# EAGLE design Battery_Monitoring_V2 (EAGLE 9.1.3)

## Sheet 1 of 2
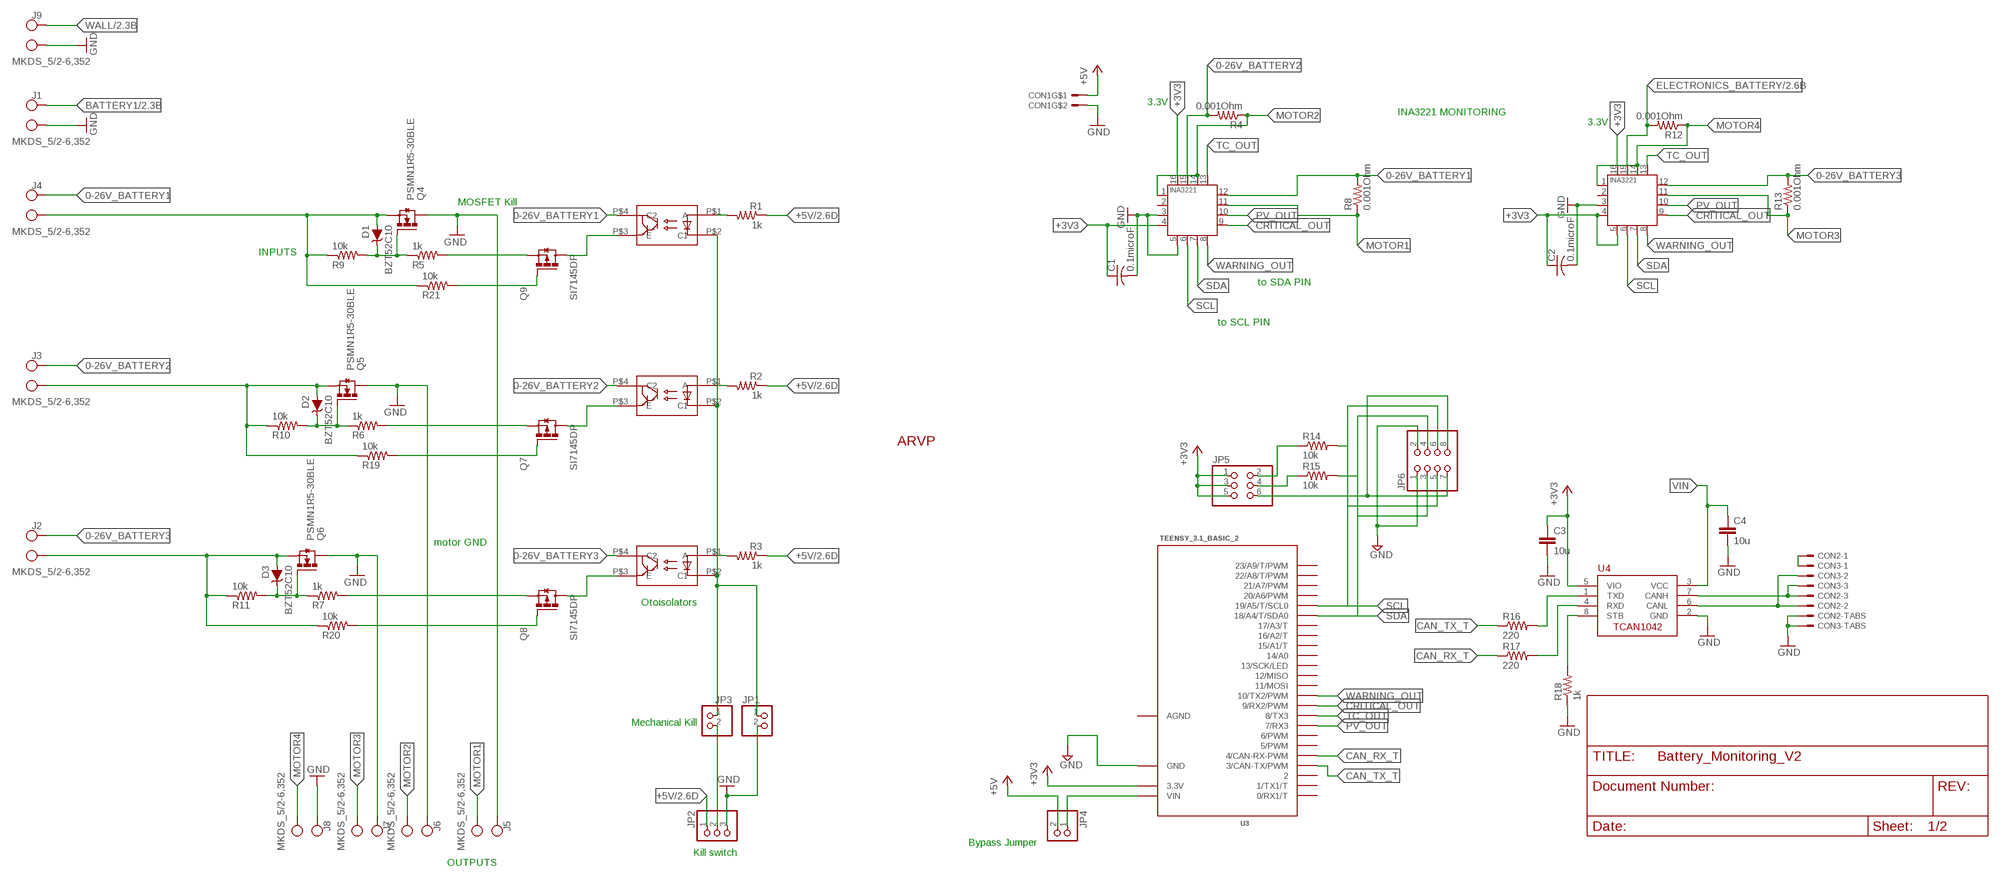
[diagram p0: schematic, sheet 1]

### Parts
ARVP1  ARVP_LOGO  [ARVP]
C1  0.1microF  C-USC2012  [C2012]
C2  0.1microF  C-USC2012  [C2012]
C3  10u  C-EUC0805  [C0805]
C4  10u  C-EUC0805  [C0805]
CON1  MOLEX_5566-2  [5566-2]
CON2  SM03B-GHS-TB  [SM03B-GHS-TB]
CON3  SM03B-GHS-TB  [SM03B-GHS-TB]
D1  BZT52C10  [SOD-123]
D2  BZT52C10  [SOD-123]
D3  BZT52C10  [SOD-123]
J1  MKDS_5/2-6,352  [MKDS_5/2-6,35]
J2  MKDS_5/2-6,352  [MKDS_5/2-6,35]
J3  MKDS_5/2-6,352  [MKDS_5/2-6,35]
J4  MKDS_5/2-6,352  [MKDS_5/2-6,35]
J5  MKDS_5/2-6,352  [MKDS_5/2-6,35]
J6  MKDS_5/2-6,352  [MKDS_5/2-6,35]
J7  MKDS_5/2-6,352  [MKDS_5/2-6,35]
J8  MKDS_5/2-6,352  [MKDS_5/2-6,35]
J9  MKDS_5/2-6,352  [MKDS_5/2-6,35]
JP1  PINHD-1X2  [1X02]
JP2  PINHD-1X3  [1X03]
JP3  PINHD-1X2  [1X02]
JP4  PINHD-1X2  [1X02]
JP5  PINHD-2X3  [2X03]
JP6  PINHD-2X4  [2X04]
Q1  TCLD1000CT  [SOP-4L]
Q2  TCLD1000CT  [SOP-4L]
Q3  TCLD1000CT  [SOP-4L]
Q4  PSMN1R5-30BLE  [SOT404/D2PAK]
Q5  PSMN1R5-30BLE  [SOT404/D2PAK]
Q6  PSMN1R5-30BLE  [SOT404/D2PAK]
Q7  SI7145DP  [SO-8/PPAK/TEST]
Q8  SI7145DP  [SO-8/PPAK/TEST]
Q9  SI7145DP  [SO-8/PPAK/TEST]
R1  1k  R-US_R0805  [R0805]
R2  1k  R-US_R0805  [R0805]
R3  1k  R-US_R0805  [R0805]
R4  0.001Ohm  HCS3920FT1L00  [3920]
R5  1k  R-US_M1206  [M1206]
R6  1k  R-US_M1206  [M1206]
R7  1k  R-US_M1206  [M1206]
R8  0.001Ohm  HCS3920FT1L00  [3920]
R9  10k  R-US_M1206  [M1206]
R10  10k  R-US_M1206  [M1206]
R11  10k  R-US_M1206  [M1206]
R12  0.001Ohm  HCS3920FT1L00  [3920]
R13  0.001Ohm  HCS3920FT1L00  [3920]
R14  10k  R-US_R1206  [R1206]
R15  10k  R-US_R1206  [R1206]
R16  220  R-US_R0805  [R0805]
R17  220  R-US_R0805  [R0805]
R18  1k  R-US_R0805  [R0805]
R19  10k  R-US_M1206  [M1206]
R20  10k  R-US_M1206  [M1206]
R21  10k  R-US_M1206  [M1206]
U1  INA3221.  [HVQFN16_4X4]
U2  INA3221.  [HVQFN16_4X4]
U3  TEENSY_3.1_BASIC_2  [TEENSY_3.1_BASIC_2]
U4  TCAN1042HVDR  [SO-8]

### Nets
0-26V_BATTERY1: J4.2(KL1) Q1.P$4(C2) R8.P$2 U1.12(IN+1)
0-26V_BATTERY2: J3.2(KL1) Q2.P$4(C2) R4.P$2 U1.15(IN+2)
0-26V_BATTERY3: J2.2(KL1) Q3.P$4(C2) R13.P$2 U2.12(IN+1)
+3V3: C1.1 C2.1 C3.1 JP5.1 JP5.3 JP5.5 U1.4(VS) U1.16(VPU) U2.4(VS) U2.5(A0) U2.16(VPU) U3.3.3V U4.5(VIO)
+5V: CON1.1 JP2.1 JP4.2 R1.1 R2.1 R3.1 ; also sheet 2
BATT1GND: D1.P$2(A) J4.1(KL) Q4.3S(S) R9.1 R21.1
BATT2GND: D2.P$2(A) J3.1(KL) Q5.3S(S) R10.1 R19.1
BATT3GND: D3.P$2(A) J2.1(KL) Q6.3S(S) R11.1 R20.1
BATTERY1: J1.2(KL1) ; also sheet 2
CAN_RX1: R17.2 U4.4(RXD)
CAN_RX_T: R17.1 U3.4(4/CAN-RX-PWM)
CAN_TX2: R16.2 U4.1(TXD)
CAN_TX_T: R16.1 U3.3(3/CAN-TX/PWM)
CANH1: CON2.P$3 CON3.P$3 U4.7(CANH)
CANL1: CON2.P$2 CON3.P$2 U4.6(CANL)
CANSH1: CON2.P$1 CON3.P$1
CRITICAL_OUT: U1.9(CRITICAL) U2.9(CRITICAL) U3.9(9/RX2/PWM)
E1: Q1.P$3(E) Q9.D@1(D) Q9.D@2(D) Q9.D@3(D) Q9.D@4(D) Q9.D@5(D)
E2: Q2.P$3(E) Q7.D@1(D) Q7.D@2(D) Q7.D@3(D) Q7.D@4(D) Q7.D@5(D)
E3: Q3.P$3(E) Q8.D@1(D) Q8.D@2(D) Q8.D@3(D) Q8.D@4(D) Q8.D@5(D)
ELECTRONICS_BATTERY: R12.P$2 U2.15(IN+2) ; also sheet 2
GND: C1.2 C2.2 C3.2 C4.2 CON1.2 CON2.P$4 CON2.P$5 CON3.P$4 CON3.P$5 J1.1(KL) J5.2(KL1) J6.2(KL1) J7.2(KL1) J8.2(KL1) J9.1(KL) JP1.2 JP2.3 JP6.1 JP6.2 Q4.2D(D) Q5.2D(D) Q6.2D(D) R18.1 U1.3(GND) U1.5(A0) U2.3(GND) U3.GND U4.2(GND) ; also sheet 2
I2C_3V1: JP5.6 JP6.7 JP6.8
MG1: D1.P$1(C) Q4.1G(G) R5.1 R9.2
MG2: D2.P$1(C) Q5.1G(G) R6.1 R10.2
MG3: D3.P$1(C) Q6.1G(G) R7.1 R11.2
MOTOR1: J5.1(KL) R8.P$1 U1.11(IN-1)
MOTOR2: J6.1(KL) R4.P$1 U1.1(IN-3) U1.14(IN-2)
MOTOR3: J7.1(KL) R13.P$1 U2.11(IN-1)
MOTOR4: J8.1(KL) R12.P$1 U2.1(IN-3) U2.14(IN-2)
N$1: Q1.P$1(A) R1.2
N$2: Q2.P$1(A) R2.2
N$3: Q3.P$1(A) R3.2
N$4: JP1.1 JP3.1 Q1.P$2(C1) Q2.P$2(C1) Q3.P$2(C1)
N$5: JP2.2 JP3.2
N$6: Q7.G R19.2
N$7: Q8.G R20.2
N$9: Q9.G R21.2
N$10: Q9.S@1(S) Q9.S@2(S) Q9.S@3(S) R5.2
N$12: Q8.S@1(S) Q8.S@2(S) Q8.S@3(S) R7.2
N$13: Q7.S@1(S) Q7.S@2(S) Q7.S@3(S) R6.2
PV_OUT: U1.10(PV) U2.10(PV) U3.7(7/RX3)
SCL: JP6.5 JP6.6 R14.2 U1.6(SCL) U2.6(SCL) U3.19/A5(19/A5/T/SCL0)
SCL_3V1: JP5.2 R14.1
SDA: JP6.3 JP6.4 R15.2 U1.7(SDA) U2.7(SDA) U3.18/A4(18/A4/T/SDA0)
SDA_3V1: JP5.4 R15.1
STB1: R18.2 U4.8(STB)
TC_OUT: U1.13(TC) U2.13(TC) U3.8(8/TX3)
VIN: C4.1 JP4.1 U3.VIN U4.3(VCC)
WALL: J9.2(KL1) ; also sheet 2
WARNING_OUT: U1.8(WARNING) U2.8(WARNING) U3.10(10/TX2/PWM)
Unconnected: U1.2(IN+3) U2.2(IN+3) U3.0(0/RX1/T) U3.1(1/TX1/T) U3.2 U3.5(5/PWM) U3.6(6/PWM) U3.11(11/MOSI) U3.12(12/MISO) U3.13(13/SCK/LED) U3.14/A0 U3.15/A1(15/A1/T) U3.16/A2(16/A2/T) U3.17/A3(17/A3/T) U3.20/A6(20/A6/PWM) U3.21/A7(21/A7/PWM) U3.22/A8(22/A8/T/PWM) U3.23/A9(23/A9/T/PWM)

### Notes on the sheet
- 3.3V
- INA3221 MONITORING
- 3.3V
- MOSFET Kill
- INPUTS
- to SDA PIN
- to SCL PIN
- motor GND
- Otoisolators
- Mechanical Kill
- Bypass Jumper
- Kill switch
- OUTPUTS

## Sheet 2 of 2
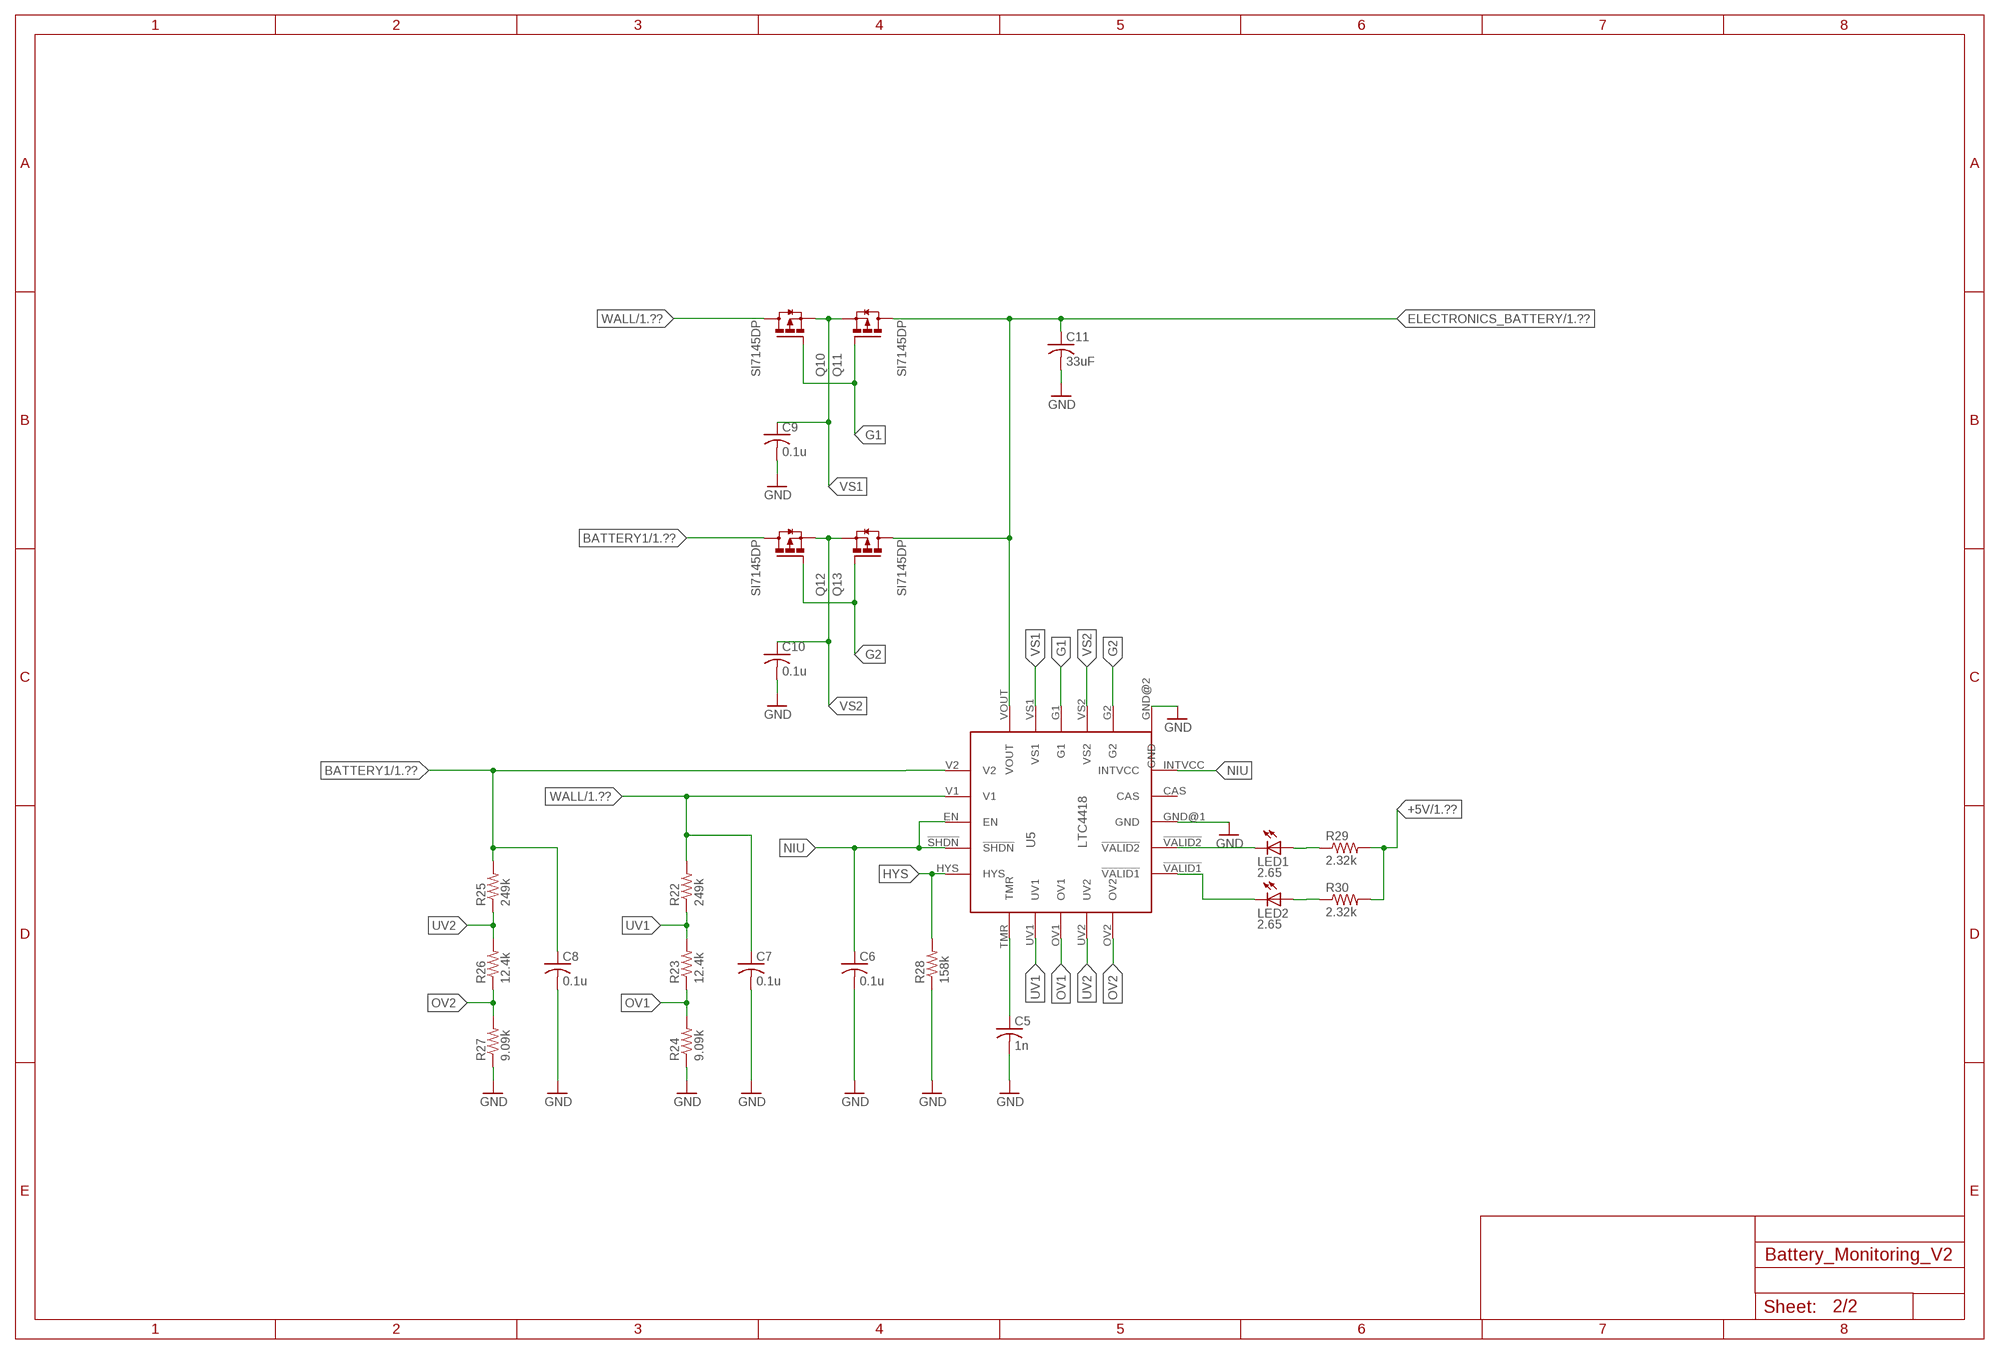
[diagram p1: schematic, sheet 2]

### Parts
C5  1n  C-USC0805  [C0805]
C6  0.1u  C-USC0805  [C0805]
C7  0.1u  C-USC0805  [C0805]
C8  0.1u  C-USC0805  [C0805]
C9  0.1u  C-USC0805  [C0805]
C10  0.1u  C-USC0805  [C0805]
C11  33uF  C-USC1206  [C1206]
LED1  2.65  LEDSML0805  [SML0805]
LED2  2.65  LEDSML0805  [SML0805]
Q10  SI7145DP  [SO-8/PPAK/TEST]
Q11  SI7145DP  [SO-8/PPAK/TEST]
Q12  SI7145DP  [SO-8/PPAK/TEST]
Q13  SI7145DP  [SO-8/PPAK/TEST]
R22  249k  R-US_R1206  [R1206]
R23  12.4k  R-US_R0805  [R0805]
R24  9.09k  R-US_R0805  [R0805]
R25  249k  R-US_R1206  [R1206]
R26  12.4k  R-US_R0805  [R0805]
R27  9.09k  R-US_R0805  [R0805]
R28  158k  R-US_R0805  [R0805]
R29  2.32k  R-US_R0805  [R0805]
R30  2.32k  R-US_R0805  [R0805]
U5  LTC4418  [20-QFN(4X4)]

### Nets
!VALID1: LED2.C U5.!VALID1
!VALID2: LED1.C U5.!VALID2
+5V: R29.2 R30.2 ; also sheet 1
BATTERY1: C8.1 Q12.D@1(D) Q12.D@2(D) Q12.D@3(D) Q12.D@4(D) Q12.D@5(D) R25.2 U5.V2 ; also sheet 1
ELECTRONICS_BATTERY: C11.1 Q11.D@1(D) Q11.D@2(D) Q11.D@3(D) Q11.D@4(D) Q11.D@5(D) Q13.D@1(D) Q13.D@2(D) Q13.D@3(D) Q13.D@4(D) Q13.D@5(D) U5.VOUT ; also sheet 1
G1: Q10.G Q11.G U5.G1
G2: Q12.G Q13.G U5.G2
GND: C5.2 C6.2 C7.2 C8.2 C9.2 C10.2 C11.2 R24.1 R27.1 R28.1 U5.GND@1(GND) U5.GND@2(GND) ; also sheet 1
HYS: R28.2 U5.HYS
N$8: LED1.A R29.1
N$11: LED2.A R30.1
N$14: C5.1 U5.TMR
NIU: C6.1 U5.!SHDN U5.EN U5.INTVCC
OV1: R23.1 R24.2 U5.OV1
OV2: R26.1 R27.2 U5.OV2
UV1: R22.1 R23.2 U5.UV1
UV2: R25.1 R26.2 U5.UV2
VS1: C9.1 Q10.S@1(S) Q10.S@2(S) Q10.S@3(S) Q11.S@1(S) Q11.S@2(S) Q11.S@3(S) U5.VS1
VS2: C10.1 Q12.S@1(S) Q12.S@2(S) Q12.S@3(S) Q13.S@1(S) Q13.S@2(S) Q13.S@3(S) U5.VS2
WALL: C7.1 Q10.D@1(D) Q10.D@2(D) Q10.D@3(D) Q10.D@4(D) Q10.D@5(D) R22.2 U5.V1 ; also sheet 1
Unconnected: U5.CAS

## Power pins joined to a net without a drawn wire
AGND: U3.AGND

## Library data of the parts
ARVP1 = ARVP:ARVP_LOGO
C1 C2 = resistor:C-US: CAPACITOR, American symbol
C3 C4 = rcl:C-EU: CAPACITOR, European symbol
C5-C11 = adafruit:C-US: CAPACITOR, American symbol
CON1 = ARVP:MOLEX_5566-2
CON2 CON3 = ARVP:SM03B-GHS-TB
D1-D3 = Moira:BZT52C10: DIODE ZENER 10V 500MW SOD123 by Diodes Incorporated Digikey: BZT52C10-FDICT-ND
J1-J9 = Moira:MKDS_5/2-6,35: CONN TERM BLOCK 2POS 6.35MM PCB, 2 Position Wire to Board Terminal Block Horizontal with Board 0.250" (6.35mm) Through Hole, Phoenix Contact (1714955), Digikey:277-1269-ND, MKDS 5/2-6,35 package adpated from Eagle library package MKDS 5/3-6,35
JP1 JP3 JP4 = pinhead:PINHD-1X2: PIN HEADER
JP2 = pinhead:PINHD-1X3: PIN HEADER
JP5 = pinhead:PINHD-2X3: PIN HEADER
JP6 = pinhead:PINHD-2X4: PIN HEADER
LED1 LED2 = led:LED: LED OSRAM: - CHIPLED LG R971, LG N971, LY N971, LG Q971, LY Q971, LO R971, LY R971 LH N974, LH R974 LS Q976, LO Q976, LY Q976 LO Q996 - Hyper CHIPLED LW Q18S LB Q993, LB Q99A, LB R99A - SideLED LS A670, LO A670, LY A670, LG A670, LP A670 LB A673, LV A673, LT A673, LW A673 LH A674 LY A675 LS A676, LA A676, LO A676, LY A676, LW A676 LS A679, LY A679, LG A679 - Hyper Micro SIDELED® LS Y876, LA Y876, LO Y876, LY Y876 LT Y87S - SmartLED LW L88C, LW L88S LB L89C, LB L89S, LG L890 LS L89K, LO L89K, LY L89K LS L896, LA L896, LO L896, LY L896 - TOPLED LS T670, LO T670, LY T670, LG T670, LP T670 LSG T670, LSP T670, LSY T670, LOP T670, LYG T670 LG T671, LOG T671, LSG T671 LB T673, LV T673, LT T673, LW T673 LH T674 LS T676, LA T676, LO T676, LY T676, LB T676, LH T676, LSB T676, LW T676 LB T67C, LV T67C, LT T67C, LS T67K, LO T67K, LY T67K, LW E67C LS E67B, LA E67B, LO E67B, LY E67B, LB E67C, LV E67C, LT E67C LW T67C LS T679, LY T679, LG T679 LS T770, LO T770, LY T770, LG T770, LP T770 LB T773, LV T773, LT T773, LW T773 LH T774 LS E675, LA E675, LY E675, LS T675 LS T776, LA T776, LO T776, LY T776, LB T776 LHGB T686 LT T68C, LB T68C - Hyper Mini TOPLED® LB M676 - Mini TOPLED Santana® LG M470 LS M47K, LO M47K, LY M47K Source: http://www.osram.convergy.de LUXEON: - LUMILED® LXK2-PW12-R00, LXK2-PW12-S00, LXK2-PW14-U00, LXK2-PW14-V00 LXK2-PM12-R00, LXK2-PM12-S00, LXK2-PM14-U00 LXK2-PE12-Q00, LXK2-PE12-R00, LXK2-PE12-S00, LXK2-PE14-T00, LXK2-PE14-U00 LXK2-PB12-K00, LXK2-PB12-L00, LXK2-PB12-M00, LXK2-PB14-N00, LXK2-PB14-P00, LXK2-PB14-Q00 LXK2-PR12-L00, LXK2-PR12-M00, LXK2-PR14-Q00, LXK2-PR14-R00 LXK2-PD12-Q00, LXK2-PD12-R00, LXK2-PD12-S00 LXK2-PH12-R00, LXK2-PH12-S00 LXK2-PL12-P00, LXK2-PL12-Q00, LXK2-PL12-R00 Source: www.luxeon.com KINGBRIGHT: KA-3528ASYC Source: www.kingbright.com
Q1 = Moira:TCLD1000CT: OPTOISOLTR 5KV DARLINGTON 4-SOP by VISHAY Digikey: TCLD1000CT_ND; SPICEPREFIX: E
Q2 Q3 = Moira:TCLD1000CT: OPTOISOLTR 5KV DARLINGTON 4-SOP by VISHAY Digikey: TCLD1000CT_ND
Q4-Q6 = Moira:PSMN1R5-30BLE: N-channel 30 V 1.5 mΩ logic level MOSFET in D2PAK by Nexperia USA Inc. Digikey: 1727-1101-1-ND
Q7-Q9 = Si7145DP:SI7145DP: MOSFET P-CH 30V 60A PPAK SO-8 Digikey: SI7145DP-T1-GE3CT-ND; MPN: SI7145DP-T1-GE3; OC_NEWARK: 63R6006
Q10-Q13 = Moira:SI7145DP: MOSFET P-CH 30V 60A PPAK SO-8 Digikey: SI7145DP-T1-GE3CT-ND
R1-R3 R5-R7 R9-R11 R22-R30 = adafruit:R-US_: RESISTOR, American symbol
R4 R8 R12 R13 = Moira:HCS3920: 0.001 Ohm ±1% 5W Chip Resistor 4020 Automotive AEC-Q200, Current Sense, Moisture Resistant Metal Element Stackpole Electronics Inc. Digikey: HCS3920FT1L00CT-ND
R14-R18 = rcl:R-US_: RESISTOR, American symbol
R19-R21 = adafruit:R-US_: RESISTOR, American symbol; MPN: RC0603FR-0710KL; OC_NEWARK: 68R0049
U1 U2 = INA3221:INA3221: The INA3221 is a three-channel, high-side current and bus voltage monitor with an I 2C- and SMBUScompatible interface. The INA3221 monitors both shunt voltage drops and bus supply voltages, in addition to having programmable conversion times and averaging modes for these signals. The INA3221 offers both critical and warning alerts to detect multiple programmable out-of-range conditions for each channel.
U3 = Teensy_3_Series_Board_v1.0:TEENSY_3.1_BASIC_2: Footprint for Teensy 3.1 board using all pin connections on the outer perimeter
U4 = ARVP:TCAN1042HVDR
U5 = Moira:LTC4418: OR Controller Source Selector Switch P-Channel 2:1 20-QFN (4x4) Digikey: LTC4418IUF#PBF-ND

## Net classes
1 net1: clearance 0.203 mm to class 0

## Board
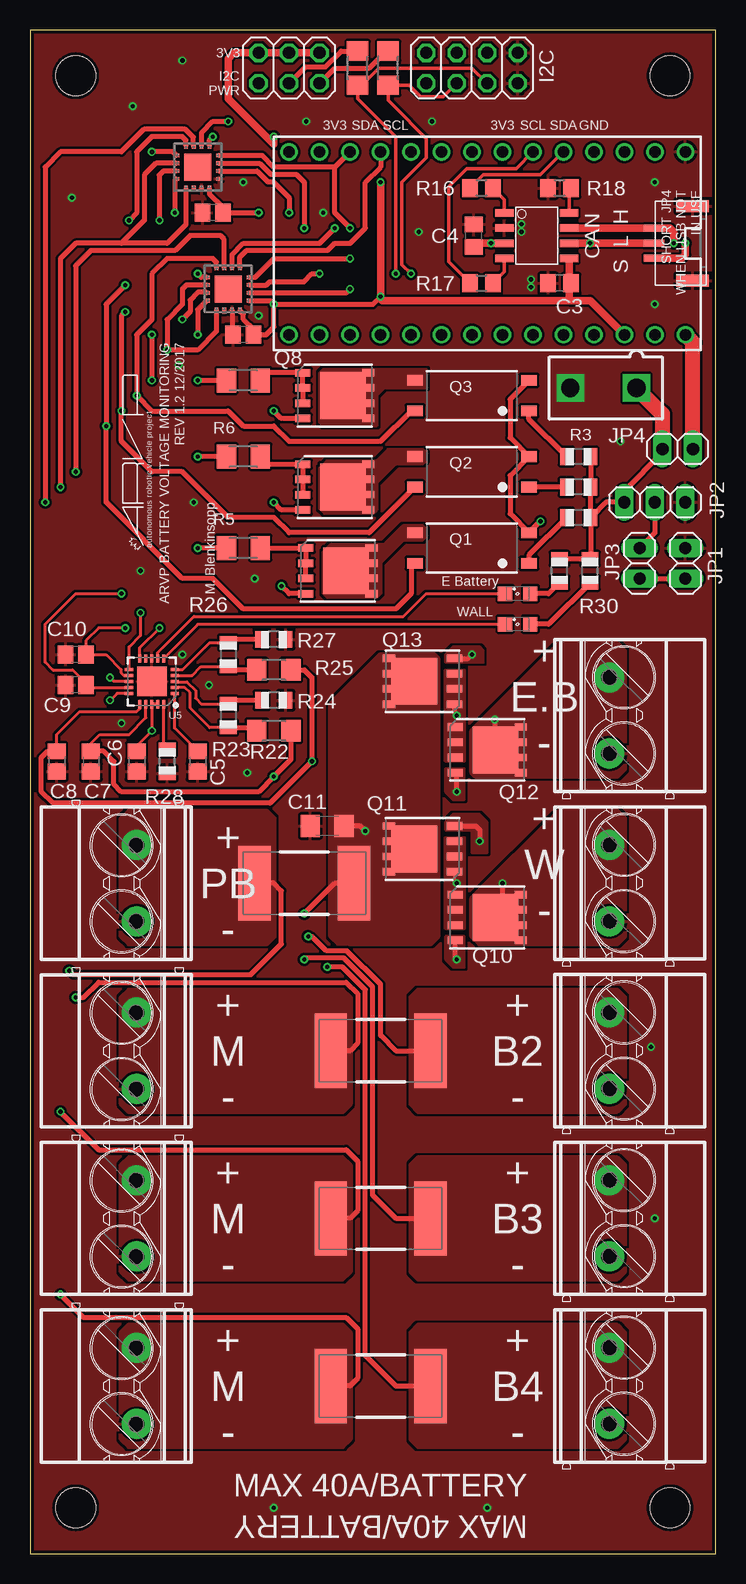
[diagram p2: board, top side]
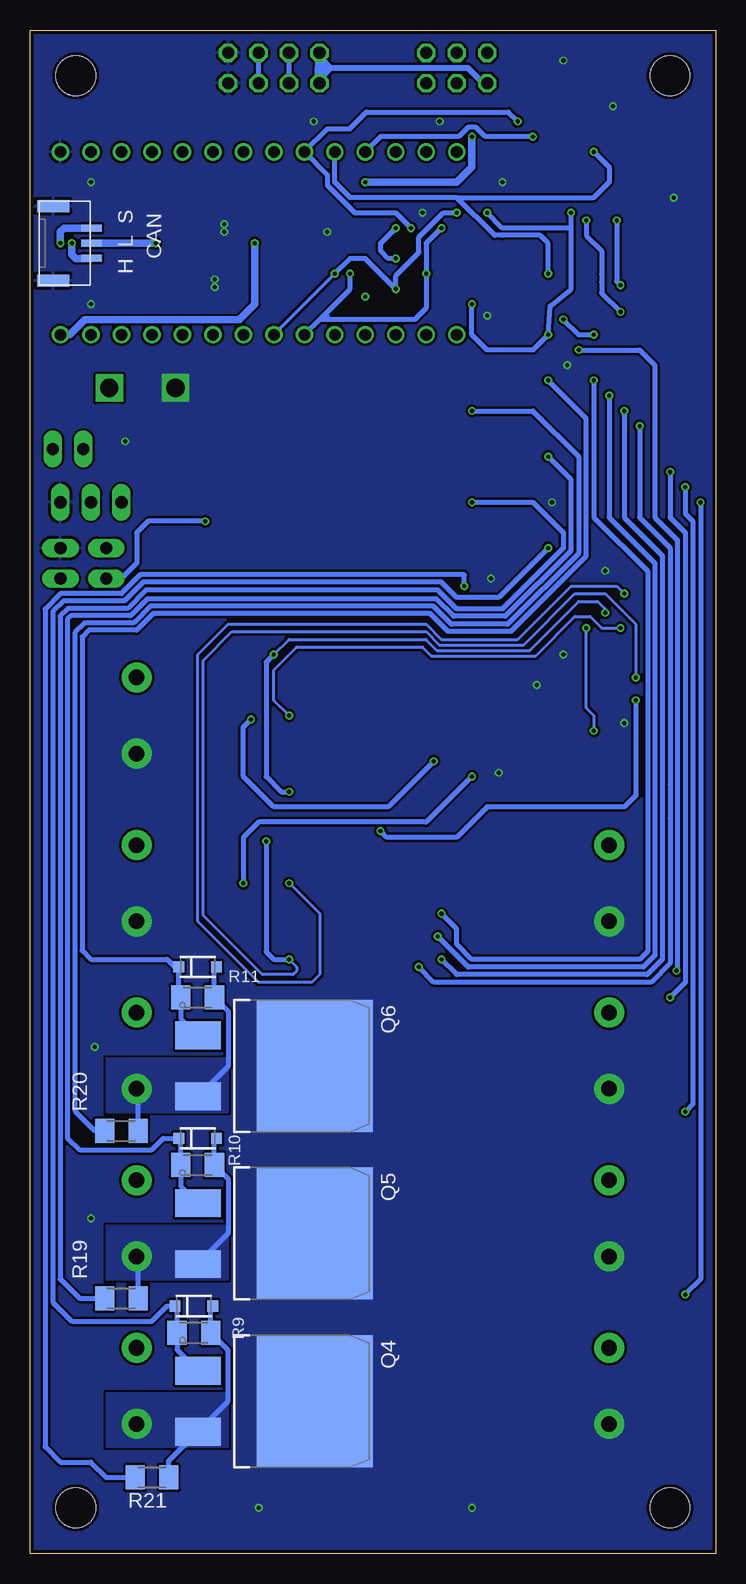
[diagram p3: board, bottom side, seen from below]

Size 57.15 x 127 mm. Coordinates in mm from the lower left corner, seen from the top.
Outline: 57.15,0 57.15,127 0,127 0,0 57.15,0
Copper layers (1*16): Top 0.035mm / dielectric 1.5mm / Bottom 0.035mm
Design rules "ITEADstudioDRC *": minimum track width 6mil, minimum drill 12mil, track to track 8mil, track to pad 8mil, pad to pad 8mil, via to via 8mil, smd to smd 0mil, copper to edge 10mil, drill to drill 10mil, minimum pad ring 6mil, minimum via ring 6mil, stop-mask expansion 2mil, vias tented up to drill 100mil, thermal gap 10mil
Milling: 4 lines

### Footprints (pad centres in the part's own frame; a part is rotated, then mirrored left to right if it is on the bottom)
C2012 = smd 1.3 x 1.5: 1 -0.85,0; 2 0.85,0
C0805 = smd 1.3 x 1.5: 1 -0.95,0; 2 0.95,0
C0805' = smd 1.3 x 1.5: 1 -0.85,0; 2 0.85,0
C1206 = smd 1.6 x 1.8: 1 -1.4,0; 2 1.4,0
5566-2 = drill 1.524 square: 1 0,-2.756; 2 0,2.756
SM03B-GHS-TB = smd 0.6 x 1.7: P$1 -1.25,0.85; P$2 0,0.85; P$3 1.25,0.85 | smd 1 x 2.7: P$4 -3.1,-2.35; P$5 3.1,-2.35
SOD-123 = smd 0.9 x 0.95: P$1 -1.575,0; P$2 1.575,0
MKDS_5/2-6,35 = drill 1.3 pad 2.5: 1 -3.175,0; 2 3.175,0
1X02 = drill 1.016 long: 1 -1.27,0; 2 1.27,0
1X03 = drill 1.016 long: 1 -2.54,0; 2 0,0; 3 2.54,0
2X03 = drill 1.016 octagon: 1 -2.54,-1.27; 2 -2.54,1.27; 3 0,-1.27; 4 0,1.27; 5 2.54,-1.27; 6 2.54,1.27
2X04 = drill 1.016 octagon: 1 -3.81,-1.27; 2 -3.81,1.27; 3 -1.27,-1.27; 4 -1.27,1.27; 5 1.27,-1.27; 6 1.27,1.27; 7 3.81,-1.27; 8 3.81,1.27
SML0805 = smd 1.2 x 1.2: A 1.05,0; C -1.05,0
SOP-4L = smd 1.3 x 0.9: P$1 -4.75,1.27; P$2 -4.75,-1.27; P$3 4.75,-1.27; P$4 4.75,1.27
SOT404/D2PAK = smd 2.32 x 3.81: 1G -2.54,-6.32; 3S 2.54,-6.32 | smd 11 x 9.65: 2D 0,3.4
SO-8/PPAK/TEST = smd 1.02 x 0.61: D@1 2.795,-1.905; D@2 2.795,-0.635; D@3 2.795,0.635; D@4 2.795,1.905 | smd 3.81 x 3.91: D@5 0.69,0 | smd 1.27 x 0.635: G -2.67,-1.905; S@1 -2.67,1.905; S@2 -2.67,0.635; S@3 -2.67,-0.635
R0805 = smd 1.1 x 1.4: 1 -1,0; 2 1,0
3920 = smd 2.7 x 6.2: P$1 -4.15,0; P$2 4.15,0
M1206 = smd 1.6 x 2: 1 -1.4,0; 2 1.4,0
R1206 = smd 1.6 x 1.803: 1 -1.422,0; 2 1.422,0
R0805' = smd 1.3 x 1.5: 1 -0.95,0; 2 0.95,0
HVQFN16_4X4 = smd 0.5 x 0.3: 1 -1.8,0.975; 2 -1.8,0.325; 3 -1.8,-0.325; 4 -1.8,-0.975; 9 1.8,-0.975; 10 1.8,-0.325; 11 1.8,0.325; 12 1.8,0.975 | smd 0.3 x 0.5: 5 -0.975,-1.8; 6 -0.325,-1.8; 7 0.325,-1.8; 8 0.975,-1.8; 13 0.975,1.8; 14 0.325,1.8; 15 -0.325,1.8; 16 -0.975,1.8 | smd 2.25 x 2.25: TH 0,0
TEENSY_3.1_BASIC_2 = drill 0.965: 0 -7.62,13.97; 1 -7.62,11.43; 2 -7.62,8.89; 3 -7.62,6.35; 3.3V 7.62,11.43; 4 -7.62,3.81; 5 -7.62,1.27; 6 -7.62,-1.27; 7 -7.62,-3.81; 8 -7.62,-6.35; 9 -7.62,-8.89; 10 -7.62,-11.43; 11 -7.62,-13.97; 12 -7.62,-16.51; 13 7.62,-16.51; 14/A0 7.62,-13.97; 15/A1 7.62,-11.43; 16/A2 7.62,-8.89; 17/A3 7.62,-6.35; 18/A4 7.62,-3.81; 19/A5 7.62,-1.27; 20/A6 7.62,1.27; 21/A7 7.62,3.81; 22/A8 7.62,6.35; 23/A9 7.62,8.89; AGND 7.62,13.97; GND -7.62,16.51; VIN 7.62,16.51
SO-8 = smd 1.524 x 0.61: 1 -2.692,1.905; 2 -2.692,0.635; 3 -2.692,-0.635; 4 -2.692,-1.905; 5 2.692,-1.905; 6 2.692,-0.635; 7 2.692,0.635; 8 2.692,1.905
20-QFN(4X4) = smd 0.25 x 0.7: !SHDN -0.5,1.9; !VALID1 -1,-1.9; !VALID2 -0.5,-1.9; CAS 0.5,-1.9; EN 0,1.9; GND@1 0,-1.9; HYS -1,1.9; INTVCC 1,-1.9; V1 0.5,1.9; V2 1,1.9 | smd 0.7 x 0.25: G1 1.9,0; G2 1.9,-1; OV1 -1.9,0; OV2 -1.9,-1; TMR -1.9,1; UV1 -1.9,0.5; UV2 -1.9,-0.5; VOUT 1.9,1; VS1 1.9,0.5; VS2 1.9,-0.5 | smd 2.45 x 2.45: GND@2 0,0
STAND-OFF = hole 3.302: 0,0

### Placement (x,y rotation side)
ARVP1  10.16,83.82 90 top
C1  15.24,111.76 180 top
C2  17.78,101.6 180 top
C3  44.13,105.89 180 top
C4  36.99,109.86 90 top
C5  1n  [C0805']  13.97,66.04 270 top
C6  0.1u  [C0805']  8.89,66.04 270 top
C7  0.1u  [C0805']  5.08,66.04 270 top
C8  0.1u  [C0805']  2.22,66.04 270 top
C9  0.1u  [C0805']  3.81,72.39 180 top
C10  0.1u  [C0805']  3.81,74.93 180 top
C11  24.77,60.64 180 top
CON1  47.78,97.16 90 top
CON2  52.86,109.22 90 top
CON3  52.86,109.22 270 bottom
D1  43.5,20.64 0 bottom
D2  43.18,34.61 0 bottom
D3  43.18,48.9 0 bottom
J1  48.26,69.85 90 top
J2  48.26,41.91 90 top
J3  48.26,27.94 90 top
J4  48.26,13.97 90 top
J5  8.89,13.97 270 top
J6  8.89,27.94 270 top
J7  8.89,41.91 270 top
J8  8.89,55.88 270 top
J9  48.26,55.88 90 top
JP1  54.61,82.55 90 top
JP2  52.07,87.63 0 top
JP3  50.8,82.55 90 top
JP4  53.97,92.08 180 top
JP5  21.59,123.83 180 top
JP6  36.83,123.83 180 top
LED1  40.64,80.01 0 top
LED2  40.64,77.47 0 top
Q1  36.83,83.82 180 top
Q2  36.83,90.17 180 top
Q3  36.83,96.52 180 top
Q4  36.83,12.7 270 bottom
Q5  36.83,26.67 270 bottom
Q6  36.83,40.64 270 bottom
Q7  25.4,88.9 0 top
Q8  25.4,96.52 0 top
Q9  25.65,81.91 0 top
Q10  38.1,53.02 0 top
Q11  32.7,58.74 180 top
Q12  38.1,66.99 0 top
Q13  32.7,72.71 180 top
R1  45.72,86.36 180 top
R2  45.72,88.9 180 top
R3  45.72,91.44 180 top
R4  29.21,27.94 0 top
R5  17.78,83.82 0 top
R6  17.78,91.44 0 top
R7  17.78,97.79 0 top
R8  29.21,13.97 0 top
R9  43.5,18.41 180 bottom
R10  43.18,32.38 180 bottom
R11  43.18,46.35 180 bottom
R12  22.86,55.88 0 top
R13  29.21,41.91 0 top
R14  29.84,123.83 270 top
R15  27.31,123.83 270 top
R16  220  [R0805']  37.62,113.82 0 top
R17  220  [R0805']  37.62,105.89 0 top
R18  1k  [R0805']  44.13,113.82 0 top
R19  49.53,21.27 180 bottom
R20  49.53,35.24 180 bottom
R21  46.99,6.35 180 bottom
R22  20.32,68.58 0 top
R23  16.51,69.85 270 top
R24  20.32,71.12 180 top
R25  20.32,73.66 0 top
R26  16.51,74.93 270 top
R27  20.32,76.2 180 top
R28  11.43,66.04 90 top
R29  44.13,81.91 90 top
R30  46.67,81.91 90 top
U1  13.97,115.57 90 top
U2  16.51,105.41 90 top
U3  38.1,109.22 270 top
U4  42.23,109.86 0 top
U5  10.16,72.71 180 top
U$9  [LETTER_P]  -63.5,-55.88 0 top  (outside the outline)
U$15  [DOCFIELD]  20.32,-55.88 0 top  (outside the outline)
U$18  [STAND-OFF]  53.34,123.19 90 top
U$24  [STAND-OFF]  53.34,3.81 90 top
U$25  [STAND-OFF]  3.81,3.81 90 top
U$26  [STAND-OFF]  3.81,123.19 90 top

### Tracks (layer width: path | path; a pad name or v marks a point on that pad's centre or on a via)
0-26V_BATTERY1  (via drill 0.35)
  Top 0.406: U1.12 13,117.81 12.7,118.11 10.16,118.11 8.89,116.84 8.89,111.76 v8.25,111.12 | v7.94,105.73 6.35,104.14 v6.35,93.98 6.35,87.63 12.7,81.28 15.24,81.28 17.78,78.74 30.48,78.74 31.75,80.01 31.75,82.22 Q1.P$4 | R8.P$2 30.48,13.97 27.94,16.51 27.94,46.99 26.03,48.9 v24.77,48.9
  Bottom 0.406: v7.94,105.73 8.25,106.05 v8.25,111.12 | v6.35,93.98 6.35,86.36 3.81,83.82 3.81,64.13 3.81,61.28 3.81,49.21 5.4,47.62 23.5,47.62 v24.77,48.9
  pour Top (no thermals): 49.53,18.41 49.53,9.52 48.89,8.89 32.39,8.89 31.75,9.52 31.75,18.41 32.39,19.05 48.89,19.05
0-26V_BATTERY2  (via drill 0.35)
  Top 0.406: U1.15 11.11,115.25 10.77,114.91 10.77,111.15 v10.8,111.12 | v7.94,103.5 7.62,103.19 v7.62,95.25 7.62,92.71 10.16,90.17 12.7,90.17 16.51,86.36 20.32,86.36 21.59,85.09 28.27,85.09 Q2.P$4 | R4.P$2 30.48,27.94 28.55,29.87 28.55,47.24 26.16,49.63 22.96,49.63 v22.86,49.53
  Bottom 0.406: v10.8,111.12 10.8,109.87 9.51,108.59 9.51,106.68 9.51,106.02 9.51,105.08 v7.94,103.5 | v7.62,95.25 7.62,86.36 4.44,83.19 4.44,64.04 4.44,49.53 5.72,48.26 21.59,48.26 v22.86,49.53
  pour Top (no thermals): 49.53,32.38 49.53,23.49 48.89,22.86 32.39,22.86 31.75,23.49 31.75,32.38 32.39,33.02 48.89,33.02
0-26V_BATTERY3  (via drill 0.35)
  Top 0.406: U2.12 15.53,107.66 15.24,107.95 11.43,107.95 10.16,106.68 10.16,102.87 8.89,101.6 v8.89,96.52 10.16,95.25 16.51,95.25 17.78,93.98 20.32,93.98 21.59,92.71 29.21,92.71 31.75,95.25 Q3.P$4 | R13.P$2 30.48,41.91 29.21,43.18 29.21,47.44 26.42,50.24 24.69,50.24 23.5,51.43 v23.18,51.43
  Bottom 0.406: v8.89,96.52 8.89,86.36 5.08,82.55 5.08,49.85 6.03,48.9 20.64,48.9 v23.18,51.43
  pour Top (no thermals): 49.53,46.35 49.53,37.46 48.89,36.83 32.39,36.83 31.75,37.46 31.75,46.35 32.39,46.99 48.89,46.99
!VALID1
  Top 0.254: U5.!VALID1 13.97,77.42 13.97,77.47 LED2.C
!VALID2
  Top 0.254: U5.!VALID2 10.66,75.11 13.65,78.11 31.11,78.11 33.02,80.01 LED1.C
+3V3  (via drill 0.35)
  Top 0.406: U2.4 17.78,103.31 17.78,102.87 18.63,102.02 C2.1 19.69,101.6 20.32,102.24 v20.32,104.14 | U1.4 14.94,113.33 16.09,112.18 C1.1 v19.05,111.76 | U1.16 12.06,114.49 v12.06,111.76 | U2.16 13.97,103.69 v13.97,101.6 | v20.32,104.14 20.03,104.44 U2.5 | v20.32,104.14 28.58,104.14 v29.21,104.78
  Top 0.61: v20.32,118.11 20.32,117.47 16.51,121.28 16.51,124.62 16.99,125.09 JP5.5 JP5.3 JP5.1 | U3.3.3V 46.67,104.46 44.93,104.46 | 44.93,104.46 29.37,104.46 29.21,104.62 v29.21,104.78 v29.21,114.3 | U4.5 44.92,106.05 C3.1 44.93,105.73 44.93,104.46
  Bottom 0.406: 12.06,110.49 v12.06,111.76 | 12.06,110.49 17.78,110.49 v19.05,111.76 | v20.32,104.14 20.32,101.6 19.05,100.33 15.24,100.33 v13.97,101.6 13.81,103.98 12.06,105.41 12.06,110.49
  Bottom 0.61: v20.32,118.11 20.32,115.57 21.59,114.3 v29.21,114.3
+5V
  Top 0.406: JP4.2 52.7,91.76 49.53,88.58 JP2.1 47.99,87.63 R1.1 | R3.1 R2.1 R1.1 | R1.1 46.72,82.96 R30.2 R29.2
  Top 1.27: CON1.1 52.7,94.99 JP4.2
BATT1GND
  Bottom 0.406: D1.P$2 42.1,20.46 R9.1 40.64,16.96 40.64,12.7 43.15,10.19 Q4.3S 45.59,7.72 R21.1
  pour Bottom (no thermals): 50.8,13.34 50.8,8.89 40.64,8.89 40.64,13.34
BATT2GND
  Bottom 0.406: D2.P$2 41.78,34.43 R10.1 40.64,31.24 40.64,26.67 43.18,24.13 Q5.3S | R19.1 48.13,24.63 J3.1
  pour Bottom (no thermals): 50.8,27.3 50.8,22.86 40.64,22.86 40.64,27.3
BATT3GND
  Bottom 0.406: D3.P$2 41.78,48.72 R11.1 40.64,45.21 40.64,40.61 Q6.3S | R20.1 48.13,38.6 J2.1
  pour Bottom (no thermals): 50.8,41.27 50.8,36.83 40.64,36.83 40.64,41.27
BATTERY1  (via drill 0.35)
  Top 0.254: C8.1 2.22,68.26 4.13,70.17 8.89,70.17 9.16,70.44 U5.V2
  Top 0.406: R25.2 22.86,73.66 23.5,73.03 v23.5,66.04 20,62.55 1.91,62.55 0.95,63.5 0.95,66.36 1.48,66.89 C8.1 | v38.73,69.53 38.73,67.05 Q12.D@5
  Bottom 0.406: v23.5,66.04 27.31,62.23 36.83,62.23 39.37,64.77 39.37,68.9 v38.73,69.53
  pour Top (no thermals): 48.89,64.77 37.15,64.77 36.83,65.09 36.83,68.58 44.13,75.88 48.89,75.88 49.53,75.25 49.53,65.41
CAN_RX1
  Top 0.305: U4.4 39.53,106.85 R17.2
CAN_RX_T
  Top 0.305: R17.1 34.88,107.68 34.88,113.93 36.38,115.44 40.51,115.44 U3.4
CAN_TX2
  Top 0.305: U4.1 39.53,112.86 R16.2
CAN_TX_T
  Top 0.305: U3.3 42.54,114.93 37.78,114.93 37.57,114.72 R16.1
CANH1  (via drill 0.35)
  Top 0.61: U4.7 51.99,110.49 CON2.P$3 53.36,110.47 53.66,110.17 v53.66,109.22
  Bottom 0.61: v53.66,109.22 53.66,108.27 53.34,107.95 52.03,107.95 CON3.P$3
CANL1  (via drill 0.35)
  Top 0.61: U4.6 v46.67,109.22 CON3.P$2
  Bottom 0.61: v46.67,109.22 CON3.P$2
CANSH1  (via drill 0.35)
  Top 0.61: CON2.P$1 54.31,107.97 54.61,108.27 v54.61,109.22
  Bottom 0.61: v54.61,109.22 54.61,110.17 54.31,110.47 CON3.P$1
CRITICAL_OUT  (via drill 0.35)
  Top 0.406: U1.9 14.94,117.81 v15.24,118.11 | U2.9 17.48,108.06 18.03,108.61 24.79,108.61 25.4,109.22 26.67,109.22 27.94,110.49 27.94,114.3 29.21,115.57 U3.9
  Bottom 0.406: v15.24,118.11 19.21,118.11 20,118.9 20.64,118.9 21.43,118.11 27.94,118.11 U3.9
E1
  pour Top (no thermals): 33.02,85.09 33.02,84.77 32.7,84.46 31.43,84.46 31.11,84.46 29.21,82.55 29.21,80.01 28.89,79.69 28.58,79.69 24.77,79.69 24.45,80.01 24.45,83.5 25.08,84.14 28.89,84.14 29.21,84.14 29.53,84.14 31.11,85.72 32.7,85.72 33.02,85.41
E2
  pour Top (no thermals): 33.02,91.44 33.02,91.12 32.7,90.81 31.11,90.81 30.48,90.81 28.89,89.22 28.89,87 28.58,86.68 24.55,86.68 24.13,87.1 24.13,90.49 24.77,91.12 28.89,91.12 29.84,92.08 32.39,92.08 32.7,92.08 33.02,91.76
E3
  pour Top (no thermals): 33.02,98.74 33.02,97.16 29.53,97.16 28.89,96.52 28.89,93.98 24.45,93.98 24.13,94.3 24.13,98.43 24.45,98.74
ELECTRONICS_BATTERY  (via drill 0.35)
  Top 0.254: U5.VOUT 7.25,71.71 v6.67,71.12
  Top 0.406: U2.15 14.67,105.12 13.97,105.12 13.33,104.49 13.33,103.5 v12.7,102.87 | v10.16,101.6 v10.16,97.79 | R12.P$2 25.4,55.88 v22.86,53.34 | v27.94,60.23 27.52,60.64 C11.1
  Bottom 0.406: v10.16,101.6 11.43,101.6 v12.7,102.87 | v10.16,97.79 10.16,86.36 5.69,81.89 5.69,50.19 6.35,49.53 20.32,49.53 21.59,50.8 21.59,52.07 v22.86,53.34 | v6.67,71.12 6.67,63.18 7.62,62.23 19.05,62.23 21.59,59.69 27.4,59.69 v27.94,60.23
  pour Top (no thermals): 29.21,74.93 33.66,74.93 33.97,74.61 33.97,51.43 33.34,50.8 25.72,50.8 25.08,51.43 25.08,70.8
G1  (via drill 0.35)
  Top 0.254: U5.G1 6.98,72.71 v6.67,73.03
  Top 0.406: v35.56,49.53 35.43,49.66 Q10.G | Q11.G 37.15,60.64 37.47,60.32 v37.47,59.37
  Bottom 0.254: v35.56,49.53 34.92,48.9 34.92,48.58 35.24,48.26 37.78,48.26 42.72,53.2 42.72,74.44 40.32,76.84 24.14,76.84 23.05,75.74 16.02,75.74 11.75,80.01 9.21,80.01 6.67,77.47 v6.67,73.03
  Bottom 0.406: v37.47,59.37 37.47,50.16 36.83,49.53 v35.56,49.53
  pour Top (no thermals): 35.24,61.59 34.61,60.96 34.61,60.32 36.83,60.32 36.83,58.42 38.1,58.42 38.1,60.96 37.47,61.59
  pour Top (no thermals): 34.61,49.53 35.24,48.9 36.19,48.9 36.19,51.43 34.61,51.43
G2  (via drill 0.35)
  Top 0.254: U5.G2 8.26,75.57 9.21,76.52 v9.21,78.42
  Top 0.406: Q13.G 36.51,74.61 v36.83,74.93 | v35.56,63.5 35.56,64.96 Q12.G
  Bottom 0.254: v36.83,74.93 35.56,76.2 24.15,76.2 23.24,75.29 15.52,75.29 11.43,79.38 9.84,79.38 9.21,78.74 v9.21,78.42
  Bottom 0.406: v36.83,74.93 37.47,74.3 37.47,64.77 36.19,63.5 v35.56,63.5
  pour Top (no thermals): 35.24,75.56 34.61,74.93 34.61,74.3 37.78,74.3 37.78,75.25 37.47,75.56
  pour Top (no thermals): 34.61,63.5 35.24,62.87 36.19,62.87 36.19,65.41 34.61,65.41
GND  (via drill 0.35)
  Top 0.406: 16.83,101.69 C2.2 16.83,101.69 | U2.3 16.83,101.69
  other vias: 41.75,106.2 41.75,105.57 40.96,110.81 40.96,110.17 23.02,119.38 33.5,119.38 20.32,3.81 38.1,3.81 52.07,104.14 52.07,114.3 12.7,124.46 7.62,69.22 18.1,65.09 14.92,72.39 12.38,99.06 13.65,87.63 18.73,81.28 49.21,92.71 3.49,113.03 8.57,120.65 19.05,103.19 17.78,114.3 32.39,110.17 24.45,111.76 9.21,81.91 51.75,42.23 52.07,27.94 12.7,74.93
  pour Top (no thermals): 47.15,95.73 47.15,98.58 43.02,98.58 43.02,95.73
  pour Bottom (no thermals): 47.15,95.73 47.15,98.58 43.02,98.58 43.02,95.73
  pour Bottom (rank 2): 56.83,0.32 56.83,126.68 0.32,126.68 0.32,0.32
  pour Top (rank 3): 56.83,0.32 56.83,126.68 0.32,126.68 0.32,0.32
  pour Bottom (no thermals): 6.35,54.61 6.35,50.16 11.43,50.16 11.43,54.61
  pour Bottom (no thermals): 46.36,68.58 46.36,64.77 50.17,64.77 50.17,68.58
  pour Bottom (no thermals): 39.37,33.02 39.37,20.32 6.35,20.32 6.35,33.02
  pour Bottom (no thermals): 39.37,46.99 39.37,34.29 6.35,34.29 6.35,46.99
  pour Bottom (no thermals): 39.37,19.05 39.37,6.35 6.35,6.35 6.35,19.05
  pour Bottom (no thermals): 46.36,54.61 46.36,50.8 50.17,50.8 50.17,54.61
HYS
  Top 0.254: R28.2 11.16,67.31 U5.HYS
I2C_3V1
  Bottom 0.508: JP5.6 19.37,122.56 20.64,123.83 33.02,123.83 | 33.02,124.78 32.07,123.83 33.02,122.87
  Bottom 0.813: JP6.7 33.02,124.78 33.02,123.83 33.02,122.87 JP6.8
MG1  (via drill 0.35)
  Top 0.406: R5.1 v13.97,83.82
  Bottom 0.406: Q4.1G 44.9,16.99 R9.2 44.9,20.46 D1.P$1 45.72,20.64 46.99,19.37 53.66,19.37 55.25,20.95 55.25,78.51 54.36,79.4 49.28,79.4 47.72,80.96 22.86,80.96 21.59,79.69 18.1,79.69 v13.97,83.82
MG2  (via drill 0.35)
  Top 0.406: R6.1 v13.97,91.44
  Bottom 0.406: Q5.1G 44.58,30.64 R10.2 44.58,34.43 D2.P$1 46.04,34.61 46.99,33.65 53.02,33.65 54.03,34.66 54.03,77.88 53.72,78.18 48.77,78.18 47.38,79.58 23.29,79.58 21.84,78.13 17.53,78.13 12.09,83.57 12.09,89.56 v13.97,91.44
MG3  (via drill 0.35)
  Top 0.406: R7.1 v13.97,97.79
  Bottom 0.406: Q6.1G 44.58,44.61 R11.2 44.75,46.53 D3.P$1 45.08,48.9 45.72,49.53 52.07,49.53 52.81,50.27 52.81,76.42 52.26,76.96 48.27,76.96 46.87,78.36 23.8,78.36 22.3,76.86 17.07,76.86 10.82,83.11 10.82,94.64 v13.97,97.79
MOTOR1  (via drill 0.35)
  Top 0.406: U1.11 13.61,117.41 13.61,118.07 12.95,118.72 9.5,118.72 7.62,116.84 2.54,116.84 1.27,115.57 v1.27,87.63 | R8.P$1 26.67,13.97 27.31,14.6 27.31,18.73 26.35,19.68 4.44,19.68 v2.54,21.59
  Bottom 0.406: v2.54,21.59 1.27,22.86 v1.27,87.63
  pour Top (no thermals): 26.03,8.89 8.25,8.89 7.62,9.52 7.62,18.41 8.25,19.05 26.03,19.05 26.67,18.41 26.67,9.52
MOTOR2  (via drill 0.35)
  Top 0.406: U1.14 10.48,115.9 9.53,114.94 9.53,111.12 9.5,111.1 7.62,109.22 | U1.1 13,110.78 11.43,109.22 7.62,109.22 | 7.62,109.22 3.81,109.22 | 3.81,109.22 | 3.81,109.22 2.54,107.95 v2.54,88.9 | v2.54,36.83 5.72,33.65 26.35,33.65 27.31,32.7 27.31,28.57 26.67,27.94 R4.P$1
  Bottom 0.406: v2.54,36.83 1.91,37.46 1.91,86.04 2.54,86.68 v2.54,88.9
  pour Top (no thermals): 26.03,22.86 8.25,22.86 7.62,23.49 7.62,32.38 8.25,33.02 26.03,33.02 26.67,32.38 26.67,23.49
MOTOR3  (via drill 0.35)
  Top 0.406: U2.11 16.19,109.55 15.88,109.86 13.33,109.86 12.09,108.61 10.16,108.61 5.08,108.61 3.81,107.34 v3.81,90.17 | R13.P$1 26.67,41.91 27.31,42.54 27.31,46.67 26.35,47.62 5.72,47.62 4.44,46.35 v3.81,46.35
  Bottom 0.406: v3.81,90.17 3.81,86.36 2.54,85.09 2.54,47.62 v3.81,46.35
  pour Top (no thermals): 26.03,36.83 8.25,36.83 7.62,37.46 7.62,46.35 8.25,46.99 26.03,46.99 26.67,46.35 26.67,37.46
MOTOR4  (via drill 0.35)
  Top 0.406: U2.14 13.03,105.74 12.7,105.41 12.7,104.14 11.43,102.87 v11.43,100.33 13.97,100.33 15.53,101.9 U2.1 | 20.32,55.88 19.69,55.88 | 19.69,55.88 R12.P$1 | v3.27,48.58 3.59,48.26 18.42,48.26 20.95,50.8 20.95,55.24 20.32,55.88 | 20.32,55.88 19.69,55.88
  Bottom 0.406: v11.43,100.33 6.35,100.33 5.08,99.06 5.08,86.36 3.17,84.46 3.17,48.68 v3.27,48.58
  pour Top (no thermals): 19.69,50.8 8.25,50.8 7.62,51.43 7.62,61.28 8.25,61.91 19.69,61.91 20.32,61.28 20.32,51.43
N$1
  Top 0.406: R1.2 41.58,83.22 Q1.P$1
N$2
  Top 0.406: R2.2 Q2.P$1
N$3
  Top 0.406: R3.2 41.58,94.58 Q3.P$1
N$4  (via drill 0.35)
  Top 0.406: JP3.1 JP1.1 | Q3.P$2 40,96.22 40,93.02 Q2.P$2 40,89.87 40,86.68 41.58,85.1 Q1.P$2 42.53,86.04 v42.55,86.04
  Bottom 0.406: v42.55,86.04 47.31,86.04 48.26,85.09 48.26,82.55 49.53,81.28 JP3.1
N$5
  Top 0.406: JP2.2 52.07,85.09 JP3.2
N$6  (via drill 0.35)
  Top 0.406: Q7.G 20.95,87 v20.32,87.63
  Bottom 0.406: v20.32,87.63 15.24,87.63 12.7,85.09 12.7,83.82 17.78,78.74 21.59,78.74 23.18,80.33 47.49,80.33 49.03,78.79 53.97,78.79 54.64,78.13 54.64,22.88 53.02,21.27 R19.2
N$7  (via drill 0.35)
  Top 0.406: Q8.G 20.95,94.62 v20.32,95.25
  Bottom 0.406: v20.32,95.25 15.24,95.25 11.43,91.44 11.43,83.37 17.33,77.47 22.04,77.47 23.54,78.97 47.12,78.97 48.44,77.65 | 48.44,77.65 48.52,77.57 | 48.44,77.65 48.52,77.57 | 48.52,77.57 52.6,77.57 53.42,76.76 53.42,36.91 51.75,35.24 R20.2
N$8
  Top 0.406: R29.1 43.23,80.01 LED1.A
N$9  (via drill 0.35)
  Top 0.406: Q9.G 21.59,80.01 v20.95,80.65
  Bottom 0.406: v20.95,80.65 20.95,81.6 47.94,81.6 49.53,80.01 54.61,80.01 55.88,78.74 55.88,8.89 54.61,7.62 52.07,7.62 50.8,6.35 R21.2
N$10
  Top 0.406: R5.2 Q9.S@1 Q9.S@2 Q9.S@3
N$11
  Top 0.406: R30.1 43.23,77.47 LED2.A
N$12
  Top 0.406: Q8.S@3 Q8.S@2 Q8.S@1 19.81,98.43 R7.2
N$13
  Top 0.406: R6.2 19.81,90.81 Q7.S@1 Q7.S@2 Q7.S@3
N$14
  Top 0.254: C5.1 12.06,68.8 U5.TMR
NIU  (via drill 0.35)
  Top 0.254: U5.!SHDN U5.EN v10.16,68.58 8.89,67.31 C6.1 | U5.INTVCC 9.16,75.52 v10.8,77.15
  Bottom 0.254: v10.16,68.58 10.16,69.85 10.8,70.48 v10.8,77.15
OV1
  Top 0.254: U5.OV1 12.1,72.66 13.07,72.66 13.79,71.94 13.79,71.3 14.29,70.8 16.46,70.8 R23.1
  Top 0.406: R24.2 16.78,71.12 R23.1
OV2
  Top 0.254: U5.OV2 12.75,73.71 14.97,75.93 R26.1
  Top 0.406: R27.2 16.78,76.2 R26.1
PV_OUT  (via drill 0.35)
  Top 0.406: U1.10 14.3,118.44 15.24,119.38 v16.51,119.38 | U2.10 16.83,108.28 17.78,109.22 24.13,109.22 v25.4,110.49
  Bottom 0.406: v25.4,110.49 26.67,111.76 30.07,111.76 32.36,114.05 32.36,114.91 U3.7 32.39,118.75 30.54,118.75 29.12,120.16 17.29,120.16 v16.51,119.38
SCL  (via drill 0.35)
  Top 0.305: v31.75,106.68 30.99,107.44 30.99,114.33 33.02,116.36 33.02,117.96 30.25,120.73 29.84,121.13 R14.2 31.59,122.4 32.56,121.44 34.44,121.44 JP6.6
  Top 0.406: U2.6 26.34,105.09 v26.67,105.41 | U1.6 18.92,115.25 19.81,114.35 20.27,114.35 21.59,113.03 v21.59,111.76
  Bottom 0.305: v31.75,106.68 U3.19/A5
  Bottom 0.406: JP6.6 JP6.5 | v31.75,106.68 30.48,107.95 29.21,107.95 v26.67,105.41 26.67,106.52 24.74,108.45 24.74,109.72 22.7,111.76 v21.59,111.76
SCL_3V1
  Top 0.406: JP5.2 25.4,123.83 28.26,123.83 29.68,125.25 R14.1
SDA  (via drill 0.35)
  Top 0.305: v30.48,106.68 30.48,118.11 27.31,121.28 R15.2 27.63,122.4 29.05,123.83 36.83,123.83 JP6.4
  Top 0.406: U2.7 19.69,105.74 19.98,106.02 22.83,106.02 23.5,106.68 v24.13,106.68 | U1.7 19.13,115.9 20.07,114.96 22.2,114.96 22.86,114.3 v22.86,110.49
  Bottom 0.305: 32.39,103.5 30.48,105.41 | 32.7,103.19 32.39,103.5 | 32.7,103.19 33.02,102.87 | 32.39,103.19 32.39,103.5 | 32.39,103.19 32.39,102.87 32.7,103.19 | 31.75,102.87 32.07,102.87 32.39,103.19
  Bottom 0.406: JP6.4 JP6.3 | 33.02,102.87 32.39,102.87 31.75,102.87 25.08,102.87 24.13,103.82 v24.13,106.68 24.13,109.22 v22.86,110.49 | 33.02,102.87 U3.18/A4 | 33.02,102.87 30.48,105.41 v30.48,106.68
SDA_3V1
  Top 0.406: JP5.4 22.96,123.93 24.61,123.93 25.93,125.25 R15.1
STB1
  Top 0.305: R18.2 44.92,113.66 U4.8
TC_OUT  (via drill 0.35)
  Top 0.406: U1.13 11.88,116.84 v10.16,116.84 | U2.13 14.27,106.38 v13.97,106.68
  Bottom 0.406: v10.16,116.84 8.89,115.57 8.89,114.3 10.16,113.03 21.59,113.03 | 21.59,113.03 30.48,113.03 31.75,114.3 U3.8 | v13.97,106.68 13.97,109.22 14.63,109.88 17.78,109.88 18.44,109.88 21.59,113.03
UV1
  Top 0.254: R23.2 14.97,68.85 13.33,70.48 13.33,71.75 12.88,72.21 U5.UV1
  Top 0.406: R23.2 18.63,68.85 R22.1
UV2
  Top 0.254: U5.UV2 13.52,73.21 14.24,73.93 R26.2
  Top 0.406: R25.1 16.78,73.66 R26.2
VIN  (via drill 0.35)
  Top 0.61: U4.3 v38.42,109.22 37.15,109.22 36.95,108.94 C4.1
  Top 1.27: U3.VIN 55.25,100.97 JP4.1
  Bottom 0.61: U3.VIN 53.83,101.6 52.59,102.84 39.71,102.84 38.42,104.14 v38.42,109.22
VS1  (via drill 0.35)
  Top 0.254: U5.VS1 4.84,72.21 C9.1 4.66,72.56 3.56,73.66 1.91,73.66 1.27,74.3 1.27,77.47 3.81,80.01 v7.62,80.01 | Q11.S@1 35.37,56.07 v35.56,55.88
  Bottom 0.254: v35.56,55.88 33.02,53.34 33.02,48.26 33.66,47.62 38.1,47.62 43.18,52.7 43.18,74.93 40.64,77.47 24.13,77.47 22.86,76.2 16.51,76.2 12.06,80.65 8.25,80.65 v7.62,80.01
  pour Top (no thermals): 34.61,59.69 36.19,59.69 36.19,52.07 34.61,52.07
VS2  (via drill 0.35)
  Top 0.254: U5.VS2 7.82,73.21 7.58,73.45 7.58,73.7 6.35,74.93 C10.1 4.66,76.1 5.72,77.15 v7.94,77.15
  Top 0.406: Q13.S@1 35.37,70.04 v35.56,69.85
  Bottom 0.254: v35.56,69.85 36.83,71.12 36.83,73.66 34.92,75.56 24.45,75.56 23.71,74.83 15.02,74.83 11.75,78.11 10.48,78.11 9.53,77.15 v7.94,77.15
  pour Top (no thermals): 34.61,73.66 36.19,73.66 36.19,66.04 34.61,66.04
WALL  (via drill 0.35)
  Top 0.254: U5.V1 9.66,69.67 8.25,68.26 5.82,68.26 5.08,67.53 C7.1
  Top 0.406: R22.2 21.74,66.19 v20.32,64.77 19.05,63.5 7.62,63.5 6.98,64.13 6.98,66.04 6.14,66.89 C7.1 | v39.37,55.88 39.37,53.6 Q10.D@5
  Bottom 0.406: v39.37,55.88 39.37,59.69 38.1,60.96 24.13,60.96 v20.32,64.77
  pour Top (no thermals): 48.89,50.8 37.47,50.8 36.83,51.43 36.83,54.61 44.13,61.91 48.89,61.91 49.53,61.28 49.53,51.43
WARNING_OUT  (via drill 0.35)
  Top 0.406: U1.8 19.34,116.55 20.32,115.57 25.4,115.57 | U3.10 25.4,115.57 | U2.8 18.75,106.38 20.32,107.95 v26.67,107.95 | v26.67,110.49 25.4,111.76 25.4,115.57
  Bottom 0.406: v26.67,107.95 27.31,107.95 27.94,108.59 27.94,109.22 v26.67,110.49

### Text on the board
tPlace: ARVP BATTERY VOLTAGE MONITORING | REV 1.2 12/2017 | M. Blenkinsopp | E Battery | WALL
tNames: 3V3 | I2C | I2C / PWR | 3V3 | SDA | SCL | 3V3 | SCL | SDA | GND | SHORT JP4 / WHEN USB NOT / IN USE | H | CAN | L | S | + / E.B / - | + / W / - | + / PB / - | + / M / - | + / B2 / - | + / M / - | + / B3 / - | + / M / - | + / B4 / - | MAX 40A/BATTERY | MAX 40A/BATTERY
bNames: S | CAN | L | H